# EasyEDA schematic M5 Stick LocoNet Interface_2020-05-23_20-37-34.json
TITLE: LocoNet Interface; REV: 1.0; Date: 2020-03-10; Sheet: 1/1; Drawn By: Hans R. Tanner; Company: IoTT - Internet of Toy Trains
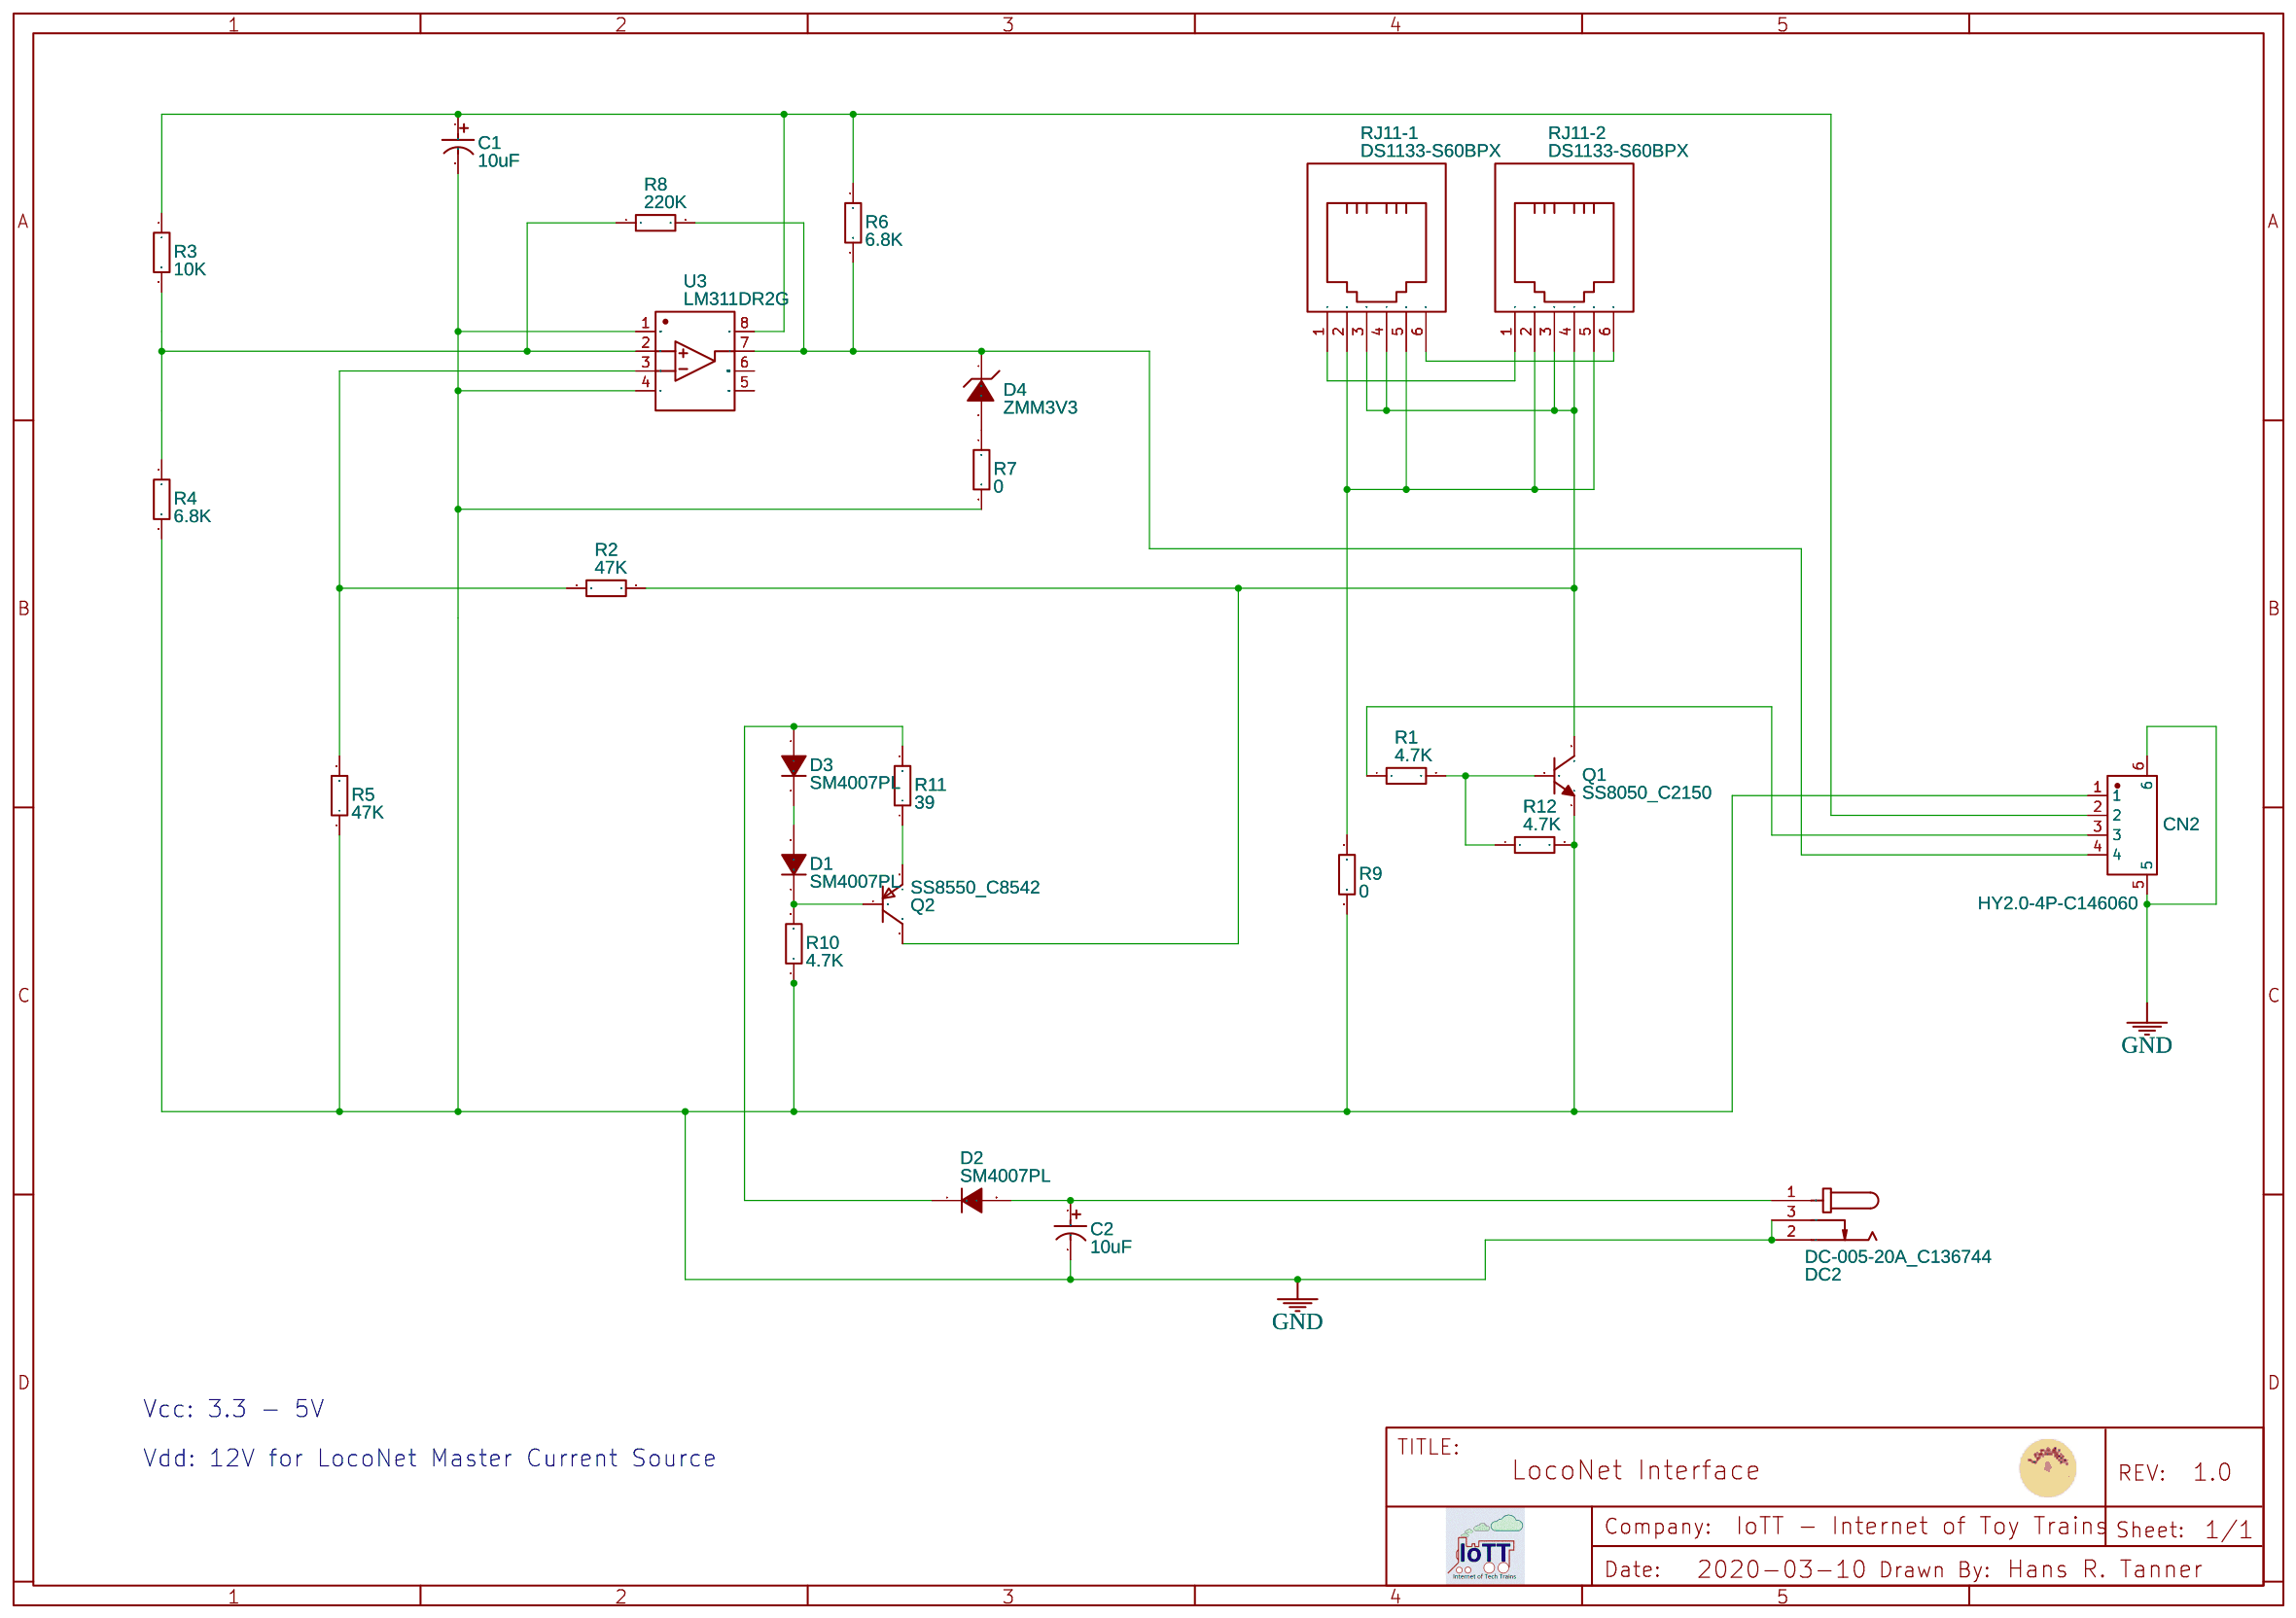
[diagram p0: schematic sheet]

## Parts
C1  10uF  [CAP-SMD_BD4.0-L4.3-W4.3-FD]
C2  10uF  [CAP-SMD_BD4.0-L4.3-W4.3-FD]
CN2  HY2.0-4P-C146060  [CONN-SMD_HY2.0-4P]
D1  SM4007PL  [SOD-123F_L2.8-W1.8-LS3.7-RD]
D2  SM4007PL  [SOD-123F_L2.8-W1.8-LS3.7-RD]
D3  SM4007PL  [SOD-123F_L2.8-W1.8-LS3.7-RD]
D4  ZMM3V3  [LL-34_L3.5-W1.5-RD]
DC2  DC-005-20A_C136744  [DC-IN-TH_DC-005-20A]
Q1  SS8050_C2150  [SOT-23-3_L2.9-W1.3-P1.90-LS2.4-BR]
Q2  SS8550_C8542  [SOT-23-3_L2.9-W1.3-P1.90-LS2.4-BR]
R1  4.7K  [R0603]
R2  47K  [R0603]
R3  10K  [R0603]
R4  6.8K  [R0603]
R5  47K  [R0603]
R6  6.8K  [R0603]
R7  0  [R0402]
R8  220K  [R0603]
R9  0  [R0402]
R10  4.7K  [R0603]
R11  39  [R0603]
R12  4.7K  [R0603]
RJ11-1  DS1133-S60BPX  [DS1133-S60BPX]
RJ11-2  DS1133-S60BPX  [DS1133-S60BPX]
U3  LM311DR2G  [SOIC-8_L5.0-W4.0-P1.27-LS6.0-BL]

## Library data of the parts
C1 C2 = VE-100M1ETR-0405: Supplier: LCSC; Manufacturer: LELON; Contributor: LCSC; Supplier Part: C134721; LCSC Assembly: Yes; SMT Type: Extend
CN2 = HY2.0-4P-C146060: Supplier: LCSC; Supplier Part: C146060; Manufacturer: Boom Precision Elec; Contributor: LCSC
D1-D3 = SM4007PL: Supplier: LCSC; Manufacturer: MDD; image: //image.lceda.cn/szlcsc/C64898.jpg; Supplier Part: C64898; LCSC Assembly: Yes; SMT Type: Basic
D4 = ZMM3V3: Supplier: LCSC; LCSC Assembly: Yes; Manufacturer: SEMTECH; image: //image.lceda.cn/szlcsc/C8056.jpg; Supplier Part: C8056; SMT Type: Basic
DC2 = DC-005-20A_C136744: Supplier: LCSC; Manufacturer: HRO; Manufacturer Part: DC-005-20A; Contributor: LCSC; Supplier Part: C136744
Q1 = SS8050_C2150: Supplier: LCSC; Manufacturer: CJ; Manufacturer Part: SS8050; LCSC Assembly: Yes; image: //image.lceda.cn/szlcsc/C2150.jpg; Supplier Part: C2150; SMT Type: Basic
Q2 = SS8550_C8542: Supplier: LCSC; Manufacturer: CJ; Manufacturer Part: SS8550; LCSC Assembly: Yes; image: //image.lceda.cn/szlcsc/C8542.jpg; Supplier Part: C8542; SMT Type: Basic
R1 R10 R12 = 0603WAF4701T5E: Supplier: LCSC; Manufacturer: UniOhm; LCSC Assembly: Yes; Supplier Part: C23162; SMT Type: Basic
R2 R5 = 0603WAF4702T5E: Supplier: LCSC; Manufacturer: UniOhm; LCSC Assembly: Yes; Supplier Part: C25819; SMT Type: Basic
R3 = 0603WAF1002T5E: Supplier: LCSC; Manufacturer: UniOhm; LCSC Assembly: Yes; Supplier Part: C25804; SMT Type: Basic
R4 R6 = 0603WAF6801T5E: Supplier: LCSC; Manufacturer: UniOhm; LCSC Assembly: Yes; Supplier Part: C23212; SMT Type: Basic
R7 R9 = 0402WGF0000TCE: Supplier: LCSC; Manufacturer: UniOhm; LCSC Assembly: Yes; Supplier Part: C17168; SMT Type: Basic
R8 = 0603WAF2203T5E: Supplier: LCSC; Manufacturer: UniOhm; LCSC Assembly: Yes; Supplier Part: C22961; SMT Type: Basic
R11 = TC0325B390JT5E: Supplier: LCSC; Manufacturer: UniOhm; Contributor: LCSC; Supplier Part: C146566; LCSC Assembly: Yes; SMT Type: Extend
RJ11-1 RJ11-2 = -: Supplier: LCSC; Manufacturer: CONNFLY; Supplier Part: C77859
U3 = LM311DR2G: Supplier: LCSC; Supplier Part: C231850; Manufacturer: ON Semicon; Contributor: LCSC; LCSC Assembly: Yes; SMT Type: Extend

## Nets
GND: C1.2 C2.2 CN2.1 CN2.5 CN2.6 DC2.2 DC2.3 Q1.2(E) R4.2 R5.1 R7.2 R9.2 R10.1 R12.2 U3.1(GND) U3.4(VEE)
Net-(C1-1): C1.1 CN2.2 R3.1 R6.1 U3.8(VCC)
Net-(C2-1): C2.1 D2.2(A) DC2.1
Net-(CN2-3): CN2.3 R1.1
Net-(CN2-4): CN2.4 D4.1(C) R6.2 R8.2 U3.7
Net-(D1-1): D1.1(C) Q2.1(B) R10.2
Net-(D1-2): D1.2(A) D3.1(C)
Net-(D2-1): D2.1(C) D3.2(A) R11.2
Net-(D4-2): D4.2(A) R7.1
Net-(Q1-1): Q1.1(B) R1.2 R12.1
Net-(Q1-3): Q1.3(C) Q2.3(C) R2.2 RJ11-1.3 RJ11-1.4 RJ11-2.3 RJ11-2.4
Net-(Q2-2): Q2.2(E) R11.1
Net-(R2-1): R2.1 R5.2 U3.3
Net-(R3-2): R3.2 R4.1 R8.1 U3.2
Net-(R9-1): R9.1 RJ11-1.2 RJ11-1.5 RJ11-2.2 RJ11-2.5
Net-(RJ11-1-1): RJ11-1.1 RJ11-2.1
Net-(RJ11-1-6): RJ11-1.6 RJ11-2.6

Not connected (* = marked no-connect by the designer): U3 5(BALANCE) 6(BALANCE/STROBE)

## Notes on the sheet
- Vcc: 3.3 - 5V
- Vdd: 12V for LocoNet Master Current Source
